# EAGLE design donut (EAGLE 7.6.0)
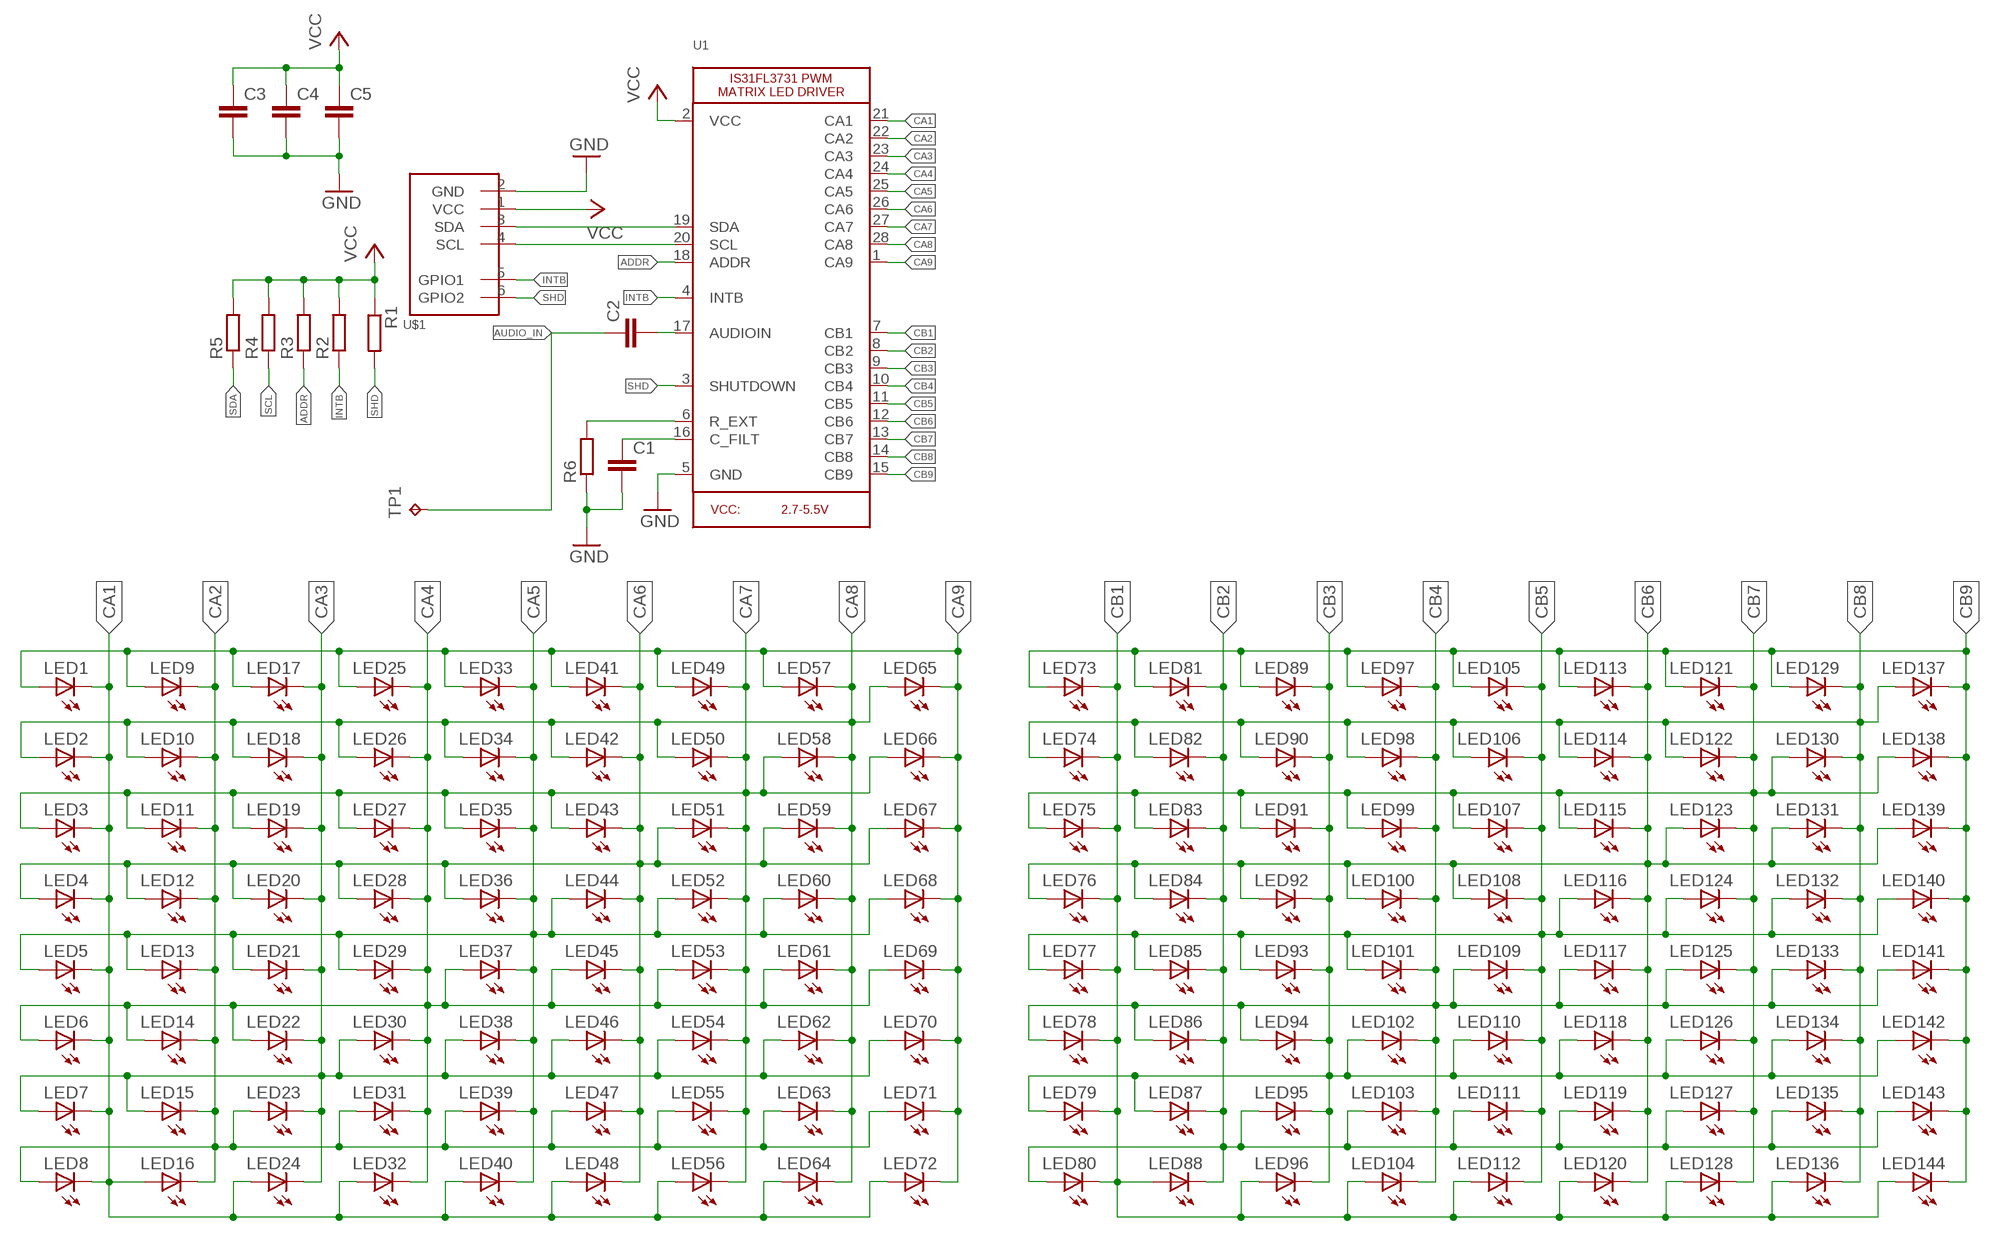
[diagram p0: schematic, sheet 1]

## Parts
C1  C-EUC0603  [C0603]
C2  C-EUC0603  [C0603]
C3  C-EUC0603  [C0603]
C4  C-EUC0603  [C0603]
C5  C-EUC0603  [C0603]
LED1  LEDCHIP-LED0603  [CHIP-LED0603]
LED2  LEDCHIP-LED0603  [CHIP-LED0603]
LED3  LEDCHIP-LED0603  [CHIP-LED0603]
LED4  LEDCHIP-LED0603  [CHIP-LED0603]
LED5  LEDCHIP-LED0603  [CHIP-LED0603]
LED6  LEDCHIP-LED0603  [CHIP-LED0603]
LED7  LEDCHIP-LED0603  [CHIP-LED0603]
LED8  LEDCHIP-LED0603  [CHIP-LED0603]
LED9  LEDCHIP-LED0603  [CHIP-LED0603]
LED10  LEDCHIP-LED0603  [CHIP-LED0603]
LED11  LEDCHIP-LED0603  [CHIP-LED0603]
LED12  LEDCHIP-LED0603  [CHIP-LED0603]
LED13  LEDCHIP-LED0603  [CHIP-LED0603]
LED14  LEDCHIP-LED0603  [CHIP-LED0603]
LED15  LEDCHIP-LED0603  [CHIP-LED0603]
LED16  LEDCHIP-LED0603  [CHIP-LED0603]
LED17  LEDCHIP-LED0603  [CHIP-LED0603]
LED18  LEDCHIP-LED0603  [CHIP-LED0603]
LED19  LEDCHIP-LED0603  [CHIP-LED0603]
LED20  LEDCHIP-LED0603  [CHIP-LED0603]
LED21  LEDCHIP-LED0603  [CHIP-LED0603]
LED22  LEDCHIP-LED0603  [CHIP-LED0603]
LED23  LEDCHIP-LED0603  [CHIP-LED0603]
LED24  LEDCHIP-LED0603  [CHIP-LED0603]
LED25  LEDCHIP-LED0603  [CHIP-LED0603]
LED26  LEDCHIP-LED0603  [CHIP-LED0603]
LED27  LEDCHIP-LED0603  [CHIP-LED0603]
LED28  LEDCHIP-LED0603  [CHIP-LED0603]
LED29  LEDCHIP-LED0603  [CHIP-LED0603]
LED30  LEDCHIP-LED0603  [CHIP-LED0603]
LED31  LEDCHIP-LED0603  [CHIP-LED0603]
LED32  LEDCHIP-LED0603  [CHIP-LED0603]
LED33  LEDCHIP-LED0603  [CHIP-LED0603]
LED34  LEDCHIP-LED0603  [CHIP-LED0603]
LED35  LEDCHIP-LED0603  [CHIP-LED0603]
LED36  LEDCHIP-LED0603  [CHIP-LED0603]
LED37  LEDCHIP-LED0603  [CHIP-LED0603]
LED38  LEDCHIP-LED0603  [CHIP-LED0603]
LED39  LEDCHIP-LED0603  [CHIP-LED0603]
LED40  LEDCHIP-LED0603  [CHIP-LED0603]
LED41  LEDCHIP-LED0603  [CHIP-LED0603]
LED42  LEDCHIP-LED0603  [CHIP-LED0603]
LED43  LEDCHIP-LED0603  [CHIP-LED0603]
LED44  LEDCHIP-LED0603  [CHIP-LED0603]
LED45  LEDCHIP-LED0603  [CHIP-LED0603]
LED46  LEDCHIP-LED0603  [CHIP-LED0603]
LED47  LEDCHIP-LED0603  [CHIP-LED0603]
LED48  LEDCHIP-LED0603  [CHIP-LED0603]
LED49  LEDCHIP-LED0603  [CHIP-LED0603]
LED50  LEDCHIP-LED0603  [CHIP-LED0603]
LED51  LEDCHIP-LED0603  [CHIP-LED0603]
LED52  LEDCHIP-LED0603  [CHIP-LED0603]
LED53  LEDCHIP-LED0603  [CHIP-LED0603]
LED54  LEDCHIP-LED0603  [CHIP-LED0603]
LED55  LEDCHIP-LED0603  [CHIP-LED0603]
LED56  LEDCHIP-LED0603  [CHIP-LED0603]
LED57  LEDCHIP-LED0603  [CHIP-LED0603]
LED58  LEDCHIP-LED0603  [CHIP-LED0603]
LED59  LEDCHIP-LED0603  [CHIP-LED0603]
LED60  LEDCHIP-LED0603  [CHIP-LED0603]
LED61  LEDCHIP-LED0603  [CHIP-LED0603]
LED62  LEDCHIP-LED0603  [CHIP-LED0603]
LED63  LEDCHIP-LED0603  [CHIP-LED0603]
LED64  LEDCHIP-LED0603  [CHIP-LED0603]
LED65  LEDCHIP-LED0603  [CHIP-LED0603]
LED66  LEDCHIP-LED0603  [CHIP-LED0603]
LED67  LEDCHIP-LED0603  [CHIP-LED0603]
LED68  LEDCHIP-LED0603  [CHIP-LED0603]
LED69  LEDCHIP-LED0603  [CHIP-LED0603]
LED70  LEDCHIP-LED0603  [CHIP-LED0603]
LED71  LEDCHIP-LED0603  [CHIP-LED0603]
LED72  LEDCHIP-LED0603  [CHIP-LED0603]
LED73  LEDCHIP-LED0603  [CHIP-LED0603]
LED74  LEDCHIP-LED0603  [CHIP-LED0603]
LED75  LEDCHIP-LED0603  [CHIP-LED0603]
LED76  LEDCHIP-LED0603  [CHIP-LED0603]
LED77  LEDCHIP-LED0603  [CHIP-LED0603]
LED78  LEDCHIP-LED0603  [CHIP-LED0603]
LED79  LEDCHIP-LED0603  [CHIP-LED0603]
LED80  LEDCHIP-LED0603  [CHIP-LED0603]
LED81  LEDCHIP-LED0603  [CHIP-LED0603]
LED82  LEDCHIP-LED0603  [CHIP-LED0603]
LED83  LEDCHIP-LED0603  [CHIP-LED0603]
LED84  LEDCHIP-LED0603  [CHIP-LED0603]
LED85  LEDCHIP-LED0603  [CHIP-LED0603]
LED86  LEDCHIP-LED0603  [CHIP-LED0603]
LED87  LEDCHIP-LED0603  [CHIP-LED0603]
LED88  LEDCHIP-LED0603  [CHIP-LED0603]
LED89  LEDCHIP-LED0603  [CHIP-LED0603]
LED90  LEDCHIP-LED0603  [CHIP-LED0603]
LED91  LEDCHIP-LED0603  [CHIP-LED0603]
LED92  LEDCHIP-LED0603  [CHIP-LED0603]
LED93  LEDCHIP-LED0603  [CHIP-LED0603]
LED94  LEDCHIP-LED0603  [CHIP-LED0603]
LED95  LEDCHIP-LED0603  [CHIP-LED0603]
LED96  LEDCHIP-LED0603  [CHIP-LED0603]
LED97  LEDCHIP-LED0603  [CHIP-LED0603]
LED98  LEDCHIP-LED0603  [CHIP-LED0603]
LED99  LEDCHIP-LED0603  [CHIP-LED0603]
LED100  LEDCHIP-LED0603  [CHIP-LED0603]
LED101  LEDCHIP-LED0603  [CHIP-LED0603]
LED102  LEDCHIP-LED0603  [CHIP-LED0603]
LED103  LEDCHIP-LED0603  [CHIP-LED0603]
LED104  LEDCHIP-LED0603  [CHIP-LED0603]
LED105  LEDCHIP-LED0603  [CHIP-LED0603]
LED106  LEDCHIP-LED0603  [CHIP-LED0603]
LED107  LEDCHIP-LED0603  [CHIP-LED0603]
LED108  LEDCHIP-LED0603  [CHIP-LED0603]
LED109  LEDCHIP-LED0603  [CHIP-LED0603]
LED110  LEDCHIP-LED0603  [CHIP-LED0603]
LED111  LEDCHIP-LED0603  [CHIP-LED0603]
LED112  LEDCHIP-LED0603  [CHIP-LED0603]
LED113  LEDCHIP-LED0603  [CHIP-LED0603]
LED114  LEDCHIP-LED0603  [CHIP-LED0603]
LED115  LEDCHIP-LED0603  [CHIP-LED0603]
LED116  LEDCHIP-LED0603  [CHIP-LED0603]
LED117  LEDCHIP-LED0603  [CHIP-LED0603]
LED118  LEDCHIP-LED0603  [CHIP-LED0603]
LED119  LEDCHIP-LED0603  [CHIP-LED0603]
LED120  LEDCHIP-LED0603  [CHIP-LED0603]
LED121  LEDCHIP-LED0603  [CHIP-LED0603]
LED122  LEDCHIP-LED0603  [CHIP-LED0603]
LED123  LEDCHIP-LED0603  [CHIP-LED0603]
LED124  LEDCHIP-LED0603  [CHIP-LED0603]
LED125  LEDCHIP-LED0603  [CHIP-LED0603]
LED126  LEDCHIP-LED0603  [CHIP-LED0603]
LED127  LEDCHIP-LED0603  [CHIP-LED0603]
LED128  LEDCHIP-LED0603  [CHIP-LED0603]
LED129  LEDCHIP-LED0603  [CHIP-LED0603]
LED130  LEDCHIP-LED0603  [CHIP-LED0603]
LED131  LEDCHIP-LED0603  [CHIP-LED0603]
LED132  LEDCHIP-LED0603  [CHIP-LED0603]
LED133  LEDCHIP-LED0603  [CHIP-LED0603]
LED134  LEDCHIP-LED0603  [CHIP-LED0603]
LED135  LEDCHIP-LED0603  [CHIP-LED0603]
LED136  LEDCHIP-LED0603  [CHIP-LED0603]
LED137  LEDCHIP-LED0603  [CHIP-LED0603]
LED138  LEDCHIP-LED0603  [CHIP-LED0603]
LED139  LEDCHIP-LED0603  [CHIP-LED0603]
LED140  LEDCHIP-LED0603  [CHIP-LED0603]
LED141  LEDCHIP-LED0603  [CHIP-LED0603]
LED142  LEDCHIP-LED0603  [CHIP-LED0603]
LED143  LEDCHIP-LED0603  [CHIP-LED0603]
LED144  LEDCHIP-LED0603  [CHIP-LED0603]
R1  R-EU_R0603  [R0603]
R2  R-EU_R0603  [R0603]
R3  R-EU_R0603  [R0603]
R4  R-EU_R0603  [R0603]
R5  R-EU_R0603  [R0603]
R6  R-EU_R0603  [R0603]
TP1  TPB1,27  [B1,27]
U1  IS31FL3731SSOP  [SSOP28DB]
U$1  SAO-SHITTY-ADDONBADGE  [2X3-SHROUDED]

## Nets
ADDR: R3.1 U1.18(ADDR)
AIN: C2.2 U1.17(AUDIOIN)
AUDIO_IN: C2.1 TP1.TP
CA1: LED1.C LED2.C LED3.C LED4.C LED5.C LED6.C LED7.C LED8.C LED16.A LED24.A LED32.A LED40.A LED48.A LED56.A LED64.A LED72.A U1.21(CA1)
CA2: LED8.A LED9.C LED10.C LED11.C LED12.C LED13.C LED14.C LED15.C LED16.C LED23.A LED31.A LED39.A LED47.A LED55.A LED63.A LED71.A U1.22(CA2)
CA3: LED7.A LED15.A LED17.C LED18.C LED19.C LED20.C LED21.C LED22.C LED23.C LED24.C LED30.A LED38.A LED46.A LED54.A LED62.A LED70.A U1.23(CA3)
CA4: LED6.A LED14.A LED22.A LED25.C LED26.C LED27.C LED28.C LED29.C LED30.C LED31.C LED32.C LED37.A LED45.A LED53.A LED61.A LED69.A U1.24(CA4)
CA5: LED5.A LED13.A LED21.A LED29.A LED33.C LED34.C LED35.C LED36.C LED37.C LED38.C LED39.C LED40.C LED44.A LED52.A LED60.A LED68.A U1.25(CA5)
CA6: LED4.A LED12.A LED20.A LED28.A LED36.A LED41.C LED42.C LED43.C LED44.C LED45.C LED46.C LED47.C LED48.C LED51.A LED59.A LED67.A U1.26(CA6)
CA7: LED3.A LED11.A LED19.A LED27.A LED35.A LED43.A LED49.C LED50.C LED51.C LED52.C LED53.C LED54.C LED55.C LED56.C LED58.A LED66.A U1.27(CA7)
CA8: LED2.A LED10.A LED18.A LED26.A LED34.A LED42.A LED50.A LED57.C LED58.C LED59.C LED60.C LED61.C LED62.C LED63.C LED64.C LED65.A U1.28(CA8)
CA9: LED1.A LED9.A LED17.A LED25.A LED33.A LED41.A LED49.A LED57.A LED65.C LED66.C LED67.C LED68.C LED69.C LED70.C LED71.C LED72.C U1.1(CA9)
CB1: LED73.C LED74.C LED75.C LED76.C LED77.C LED78.C LED79.C LED80.C LED88.A LED96.A LED104.A LED112.A LED120.A LED128.A LED136.A LED144.A U1.7(CB1)
CB2: LED80.A LED81.C LED82.C LED83.C LED84.C LED85.C LED86.C LED87.C LED88.C LED95.A LED103.A LED111.A LED119.A LED127.A LED135.A LED143.A U1.8(CB2)
CB3: LED79.A LED87.A LED89.C LED90.C LED91.C LED92.C LED93.C LED94.C LED95.C LED96.C LED102.A LED110.A LED118.A LED126.A LED134.A LED142.A U1.9(CB3)
CB4: LED78.A LED86.A LED94.A LED97.C LED98.C LED99.C LED100.C LED101.C LED102.C LED103.C LED104.C LED109.A LED117.A LED125.A LED133.A LED141.A U1.10(CB4)
CB5: LED77.A LED85.A LED93.A LED101.A LED105.C LED106.C LED107.C LED108.C LED109.C LED110.C LED111.C LED112.C LED116.A LED124.A LED132.A LED140.A U1.11(CB5)
CB6: LED76.A LED84.A LED92.A LED100.A LED108.A LED113.C LED114.C LED115.C LED116.C LED117.C LED118.C LED119.C LED120.C LED123.A LED131.A LED139.A U1.12(CB6)
CB7: LED75.A LED83.A LED91.A LED99.A LED107.A LED115.A LED121.C LED122.C LED123.C LED124.C LED125.C LED126.C LED127.C LED128.C LED130.A LED138.A U1.13(CB7)
CB8: LED74.A LED82.A LED90.A LED98.A LED106.A LED114.A LED122.A LED129.C LED130.C LED131.C LED132.C LED133.C LED134.C LED135.C LED136.C LED137.A U1.14(CB8)
CB9: LED73.A LED81.A LED89.A LED97.A LED105.A LED113.A LED121.A LED129.A LED137.C LED138.C LED139.C LED140.C LED141.C LED142.C LED143.C LED144.C U1.15(CB9)
GND: C1.2 C3.2 C4.2 C5.2 R6.1 U1.5(GND) U$1.2(GND)
INTB: R2.1 U1.4(INTB) U$1.5(GPIO1)
N$9: R6.2 U1.6(R_EXT)
N$10: C1.1 U1.16(C_FILT)
SCL: R4.1 U1.20(SCL) U$1.4(SCL)
SDA: R5.1 U1.19(SDA) U$1.3(SDA)
SHD: R1.2 U1.3(SHUTDOWN) U$1.6(GPIO2)
VCC: C3.1 C4.1 C5.1 R1.1 R2.2 R3.2 R4.2 R5.2 U1.2(VCC) U$1.1(VCC)

## Library data of the parts
C1-C5 = rcl:C-EU: CAPACITOR, European symbol
LED1-LED144 = led:LED: LED OSRAM: - CHIPLED LG R971, LG N971, LY N971, LG Q971, LY Q971, LO R971, LY R971 LH N974, LH R974 LS Q976, LO Q976, LY Q976 LO Q996 - Hyper CHIPLED LW Q18S LB Q993, LB Q99A, LB R99A - SideLED LS A670, LO A670, LY A670, LG A670, LP A670 LB A673, LV A673, LT A673, LW A673 LH A674 LY A675 LS A676, LA A676, LO A676, LY A676, LW A676 LS A679, LY A679, LG A679 - Hyper Micro SIDELED® LS Y876, LA Y876, LO Y876, LY Y876 LT Y87S - SmartLED LW L88C, LW L88S LB L89C, LB L89S, LG L890 LS L89K, LO L89K, LY L89K LS L896, LA L896, LO L896, LY L896 - TOPLED LS T670, LO T670, LY T670, LG T670, LP T670 LSG T670, LSP T670, LSY T670, LOP T670, LYG T670 LG T671, LOG T671, LSG T671 LB T673, LV T673, LT T673, LW T673 LH T674 LS T676, LA T676, LO T676, LY T676, LB T676, LH T676, LSB T676, LW T676 LB T67C, LV T67C, LT T67C, LS T67K, LO T67K, LY T67K, LW E67C LS E67B, LA E67B, LO E67B, LY E67B, LB E67C, LV E67C, LT E67C LW T67C LS T679, LY T679, LG T679 LS T770, LO T770, LY T770, LG T770, LP T770 LB T773, LV T773, LT T773, LW T773 LH T774 LS E675, LA E675, LY E675, LS T675 LS T776, LA T776, LO T776, LY T776, LB T776 LHGB T686 LT T68C, LB T68C - Hyper Mini TOPLED® LB M676 - Mini TOPLED Santana® LG M470 LS M47K, LO M47K, LY M47K Source: http://www.osram.convergy.de LUXEON: - LUMILED® LXK2-PW12-R00, LXK2-PW12-S00, LXK2-PW14-U00, LXK2-PW14-V00 LXK2-PM12-R00, LXK2-PM12-S00, LXK2-PM14-U00 LXK2-PE12-Q00, LXK2-PE12-R00, LXK2-PE12-S00, LXK2-PE14-T00, LXK2-PE14-U00 LXK2-PB12-K00, LXK2-PB12-L00, LXK2-PB12-M00, LXK2-PB14-N00, LXK2-PB14-P00, LXK2-PB14-Q00 LXK2-PR12-L00, LXK2-PR12-M00, LXK2-PR14-Q00, LXK2-PR14-R00 LXK2-PD12-Q00, LXK2-PD12-R00, LXK2-PD12-S00 LXK2-PH12-R00, LXK2-PH12-S00 LXK2-PL12-P00, LXK2-PL12-Q00, LXK2-PL12-R00 Source: www.luxeon.com KINGBRIGHT: KA-3528ASYC Source: www.kingbright.com
R1-R6 = rcl:R-EU_: RESISTOR, European symbol
TP1 = testpad:TP: Test pad
U1 = nightcapaudio:IS31FL3731: IS31FL3731 PWM LED Matrix Driver
U$1 = SparkFun-Connectors:SAO-SHITTY-ADDON

## Board
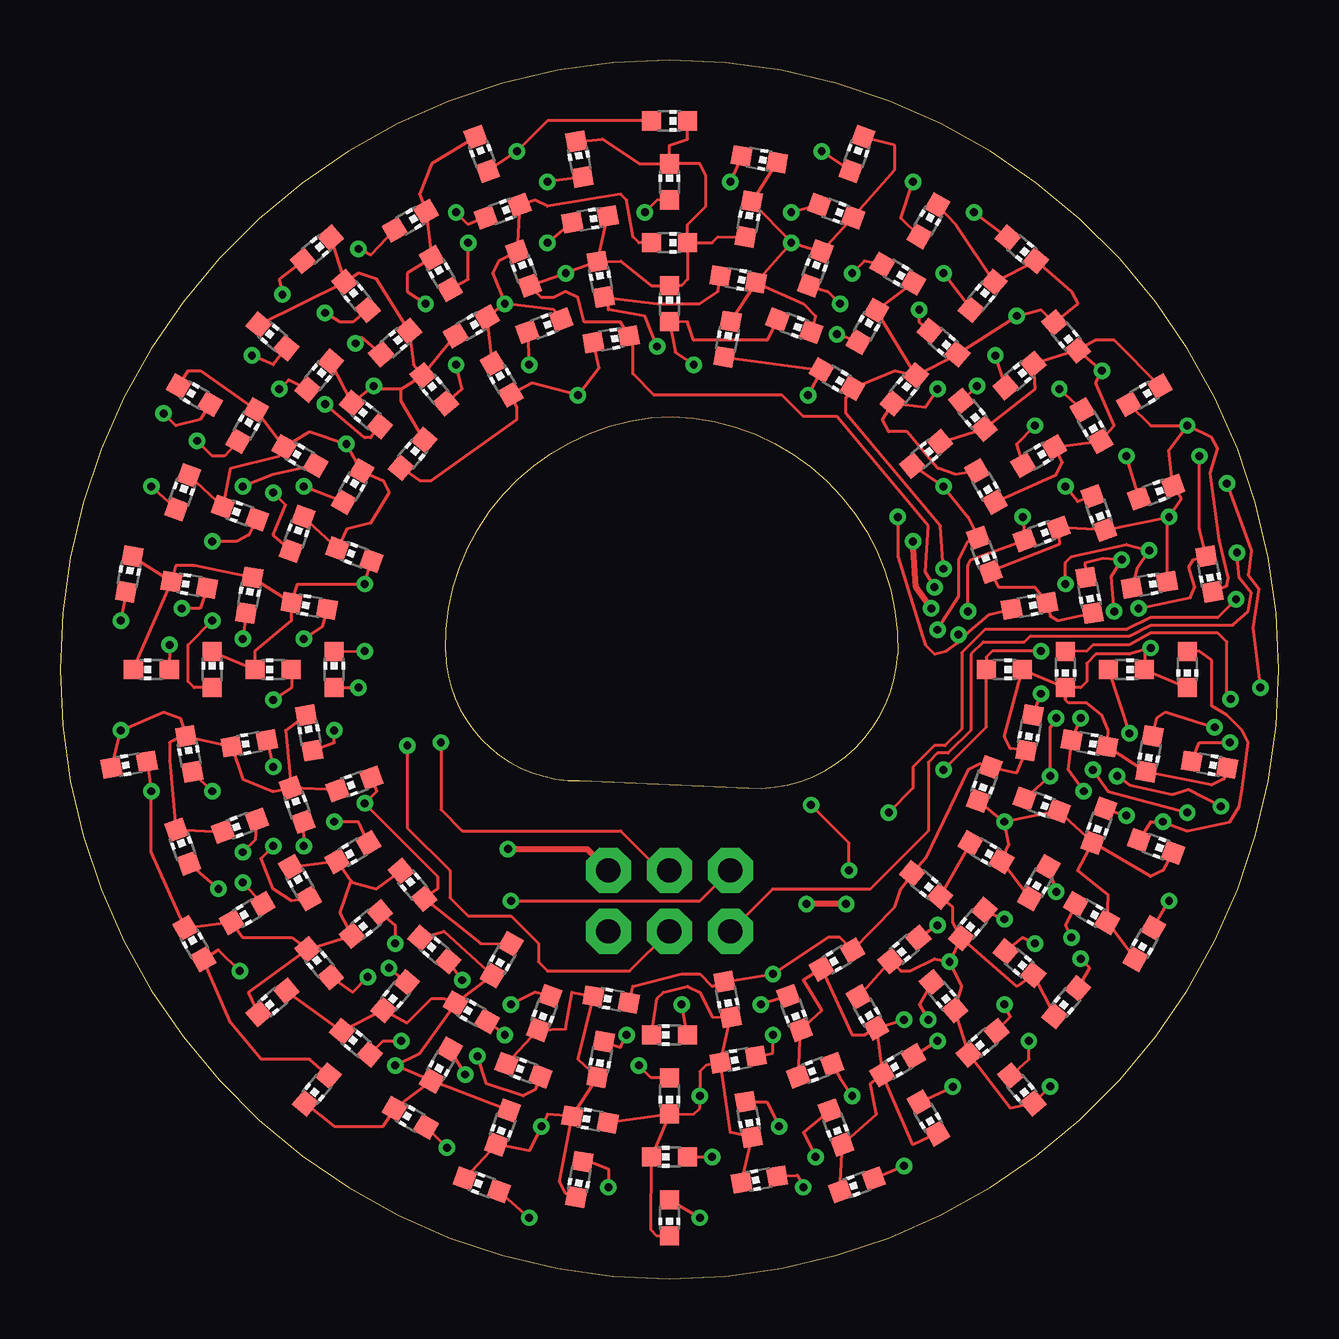
[diagram p1: board, top side]
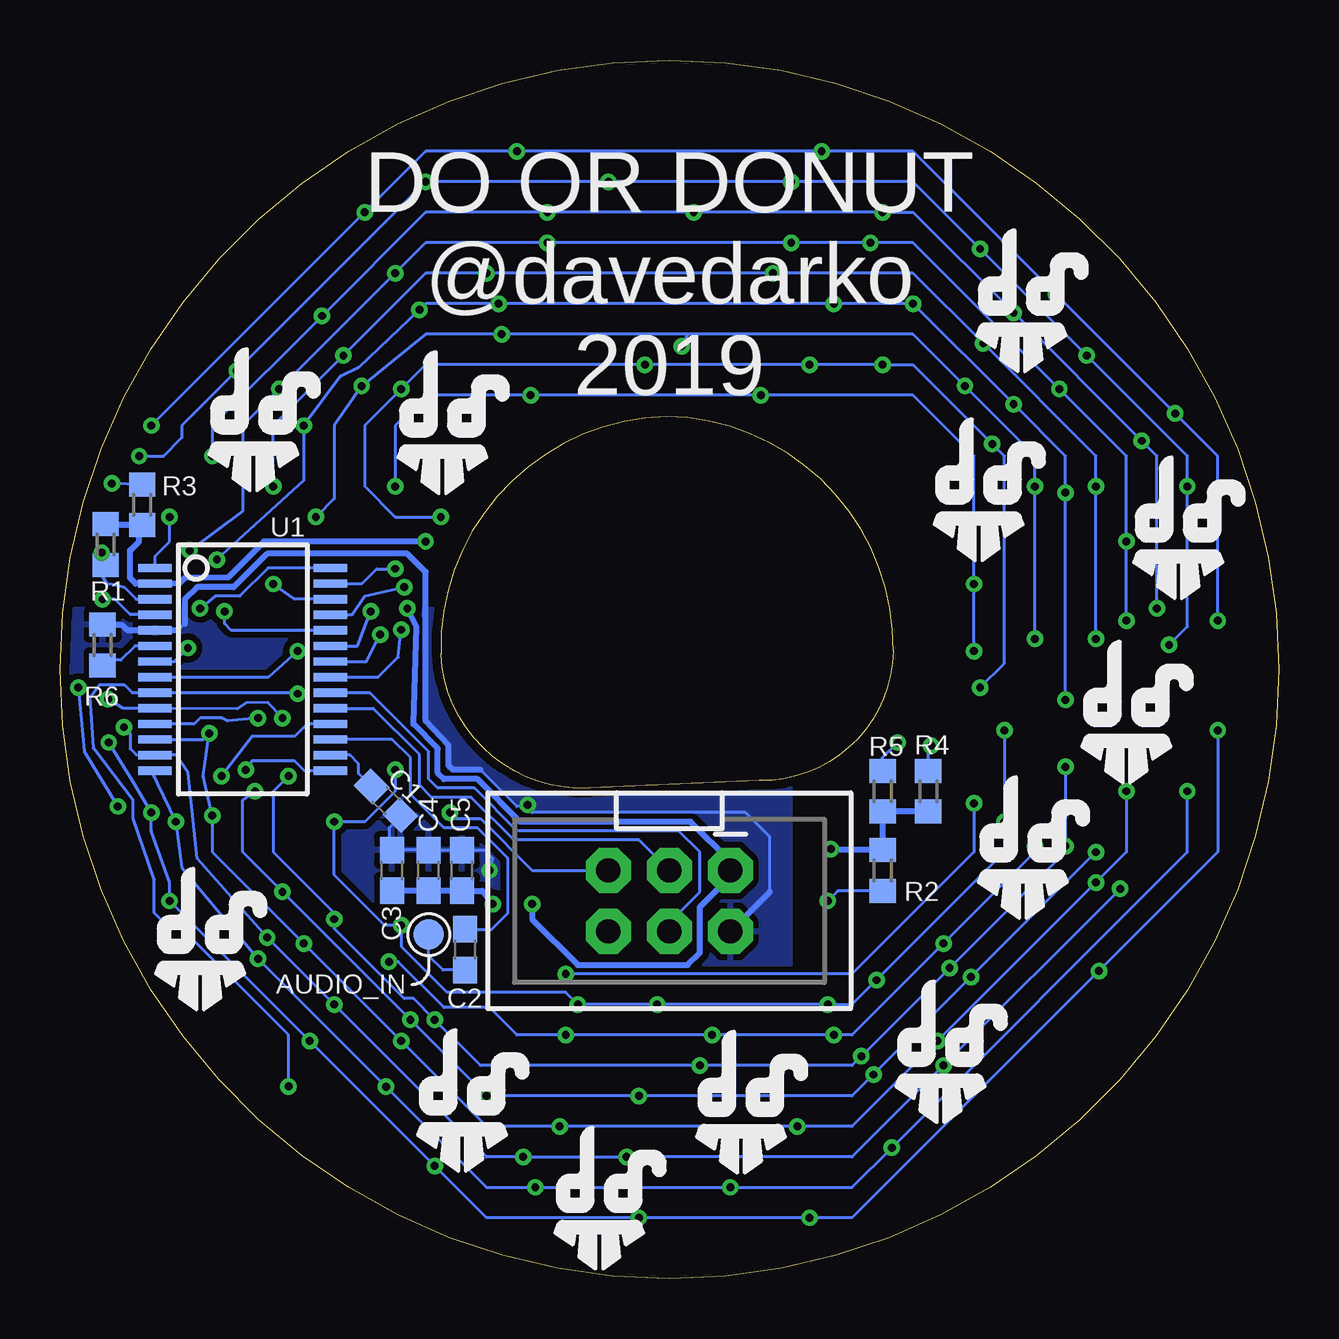
[diagram p2: board, bottom side, seen from below]

Size 50.8 x 50.8 mm. Coordinates in mm from the lower left corner, seen from the top.
Outline: 0,25.4 arc90 25.4,0 arc90 50.8,25.4 arc90 25.4,50.8 arc90 0,25.4
Outline: 16.07,26.16 arc-90 25.53,35.94 arc-90 34.92,26.04 arc-90 28.7,20.45 21.65,20.77 arc-90 16.07,26.16
Copper layers (1*16): Top 0.0356mm / dielectric 1.5011mm / Bottom 0.0356mm
Design rules "LaenPCBOrder *": minimum track width 5mil, minimum drill 13mil, track to track 5mil, track to pad 5mil, pad to pad 5mil, via to via 5mil, smd to smd 5mil, copper to edge 15mil, drill to drill 6mil, minimum pad ring 7mil, minimum via ring 7mil, stop-mask expansion 3mil, vias tented up to drill 200mil, thermal gap 10mil

### Footprints (pad centres in the part's own frame; a part is rotated, then mirrored left to right if it is on the bottom)
C0603 = smd 1.1 x 1: 1 -0.85,0; 2 0.85,0
CHIP-LED0603 = smd 0.8 x 0.8: A 0,-0.75; C 0,0.75
R0603 = smd 1 x 1.1: 1 -0.85,0; 2 0.85,0
B1,27 = smd 1.27 x 1.27: TP 0,0
SSOP28DB = smd 0.348 x 1.397: 1 -4.225,-3.656; 2 -3.575,-3.656; 3 -2.925,-3.656; 4 -2.275,-3.656; 5 -1.625,-3.656; 6 -0.975,-3.656; 7 -0.325,-3.656; 8 0.325,-3.656; 9 0.975,-3.656; 10 1.625,-3.656; 11 2.275,-3.656; 12 2.925,-3.656; 13 3.575,-3.656; 14 4.225,-3.656; 15 4.225,3.656; 16 3.575,3.656; 17 2.925,3.656; 18 2.275,3.656; 19 1.625,3.656; 20 0.975,3.656; 21 0.325,3.656; 22 -0.325,3.656; 23 -0.975,3.656; 24 -1.625,3.656; 25 -2.275,3.656; 26 -2.925,3.656; 27 -3.575,3.656; 28 -4.225,3.656
2X3-SHROUDED = drill 1.016 pad 1.88 octagon: 1 -1.27,2.54; 2 1.27,2.54; 3 -1.27,0; 4 1.27,0; 5 -1.27,-2.54; 6 1.27,-2.54

### Placement (x,y rotation side)
C1  37.21,19.92 315 bottom
C2  33.91,13.72 90 bottom
C3  36.96,17.02 90 bottom
C4  35.43,17.02 90 bottom
C5  34.04,17.02 90 bottom
LED1  2.89,29.37 350 top
LED2  3.81,25.4 90 top
LED3  5.39,28.93 80 top
LED4  6.35,25.4 0 top
LED5  7.89,28.49 350 top
LED6  8.89,25.4 90 top
LED7  10.39,28.05 80 top
LED8  11.43,25.4 0 top
LED9  5.6,36.83 60 top
LED10  5.11,32.78 340 top
LED11  7.8,35.56 330 top
LED12  7.5,31.92 70 top
LED13  10,34.29 60 top
LED14  9.89,31.05 340 top
LED15  12.2,33.02 330 top
LED16  12.27,30.18 70 top
LED17  10.71,42.91 310 top
LED18  8.86,39.28 50 top
LED19  12.34,40.97 40 top
LED20  10.81,37.65 320 top
LED21  13.97,39.02 310 top
LED22  12.75,36.01 50 top
LED23  15.6,37.07 40 top
LED24  14.7,34.38 320 top
LED25  17.58,46.88 20 top
LED26  14.6,44.1 300 top
LED27  18.45,44.49 290 top
LED28  15.87,41.9 30 top
LED29  19.32,42.11 20 top
LED30  17.14,39.7 300 top
LED31  20.19,39.72 290 top
LED32  18.41,37.5 30 top
LED33  25.4,48.26 270 top
LED34  21.65,46.66 10 top
LED35  25.4,45.72 0 top
LED36  22.09,44.16 280 top
LED37  25.4,43.18 270 top
LED38  22.53,41.66 10 top
LED39  25.4,40.64 0 top
LED40  22.97,39.16 280 top
LED41  33.22,46.88 340 top
LED42  29.15,46.66 260 top
LED43  32.35,44.49 250 top
LED44  28.71,44.16 350 top
LED45  31.48,42.11 340 top
LED46  28.27,41.66 260 top
LED47  30.61,39.72 250 top
LED48  27.83,39.16 350 top
LED49  40.09,42.91 230 top
LED50  36.2,44.1 330 top
LED51  38.46,40.97 320 top
LED52  34.92,41.9 240 top
LED53  36.83,39.02 230 top
LED54  33.65,39.7 330 top
LED55  35.2,37.07 320 top
LED56  32.38,37.5 240 top
LED57  45.2,36.83 300 top
LED58  41.94,39.28 220 top
LED59  43,35.56 210 top
LED60  39.99,37.65 310 top
LED61  40.8,34.29 300 top
LED62  38.05,36.01 220 top
LED63  38.6,33.02 210 top
LED64  36.1,34.38 310 top
LED65  47.91,29.37 190 top
LED66  45.69,32.78 290 top
LED67  45.41,28.93 280 top
LED68  43.3,31.92 200 top
LED69  42.91,28.49 190 top
LED70  40.91,31.05 290 top
LED71  40.41,28.05 280 top
LED72  38.53,30.18 200 top
LED73  47.91,21.43 260 top
LED74  46.99,25.4 180 top
LED75  45.41,21.87 170 top
LED76  44.45,25.4 270 top
LED77  42.91,22.31 260 top
LED78  41.91,25.4 180 top
LED79  40.41,22.75 170 top
LED80  39.37,25.4 270 top
LED81  45.2,13.97 150 top
LED82  45.69,18.02 250 top
LED83  43,15.24 240 top
LED84  43.3,18.88 160 top
LED85  40.8,16.51 150 top
LED86  40.91,19.75 250 top
LED87  38.6,17.78 240 top
LED88  38.53,20.62 160 top
LED89  40.09,7.89 220 top
LED90  41.94,11.52 140 top
LED91  38.46,9.83 130 top
LED92  39.99,13.15 230 top
LED93  36.83,11.78 220 top
LED94  38.05,14.79 140 top
LED95  35.2,13.73 130 top
LED96  36.1,16.42 230 top
LED97  33.22,3.92 110 top
LED98  36.19,6.7 210 top
LED99  32.35,6.31 200 top
LED100  34.92,8.9 120 top
LED101  31.48,8.69 110 top
LED102  33.65,11.1 210 top
LED103  30.61,11.08 200 top
LED104  32.38,13.3 120 top
LED105  25.4,2.54 180 top
LED106  29.15,4.14 100 top
LED107  25.4,5.08 90 top
LED108  28.71,6.64 190 top
LED109  25.4,7.62 180 top
LED110  28.27,9.14 100 top
LED111  25.4,10.16 90 top
LED112  27.83,11.64 190 top
LED113  17.58,3.92 70 top
LED114  21.65,4.14 170 top
LED115  18.45,6.31 160 top
LED116  22.09,6.64 80 top
LED117  19.32,8.69 70 top
LED118  22.53,9.14 170 top
LED119  20.19,11.08 160 top
LED120  22.97,11.64 80 top
LED121  10.71,7.89 140 top
LED122  14.6,6.7 60 top
LED123  12.34,9.83 50 top
LED124  15.87,8.9 150 top
LED125  13.97,11.78 140 top
LED126  17.14,11.1 60 top
LED127  15.6,13.73 50 top
LED128  18.41,13.3 150 top
LED129  5.6,13.97 30 top
LED130  8.86,11.52 130 top
LED131  7.8,15.24 120 top
LED132  10.81,13.15 40 top
LED133  10,16.51 30 top
LED134  12.75,14.79 130 top
LED135  12.2,17.78 120 top
LED136  14.7,16.42 40 top
LED137  2.89,21.43 100 top
LED138  5.11,18.02 20 top
LED139  5.39,21.87 10 top
LED140  7.5,18.88 110 top
LED141  7.89,22.31 100 top
LED142  9.89,19.75 20 top
LED143  10.39,22.75 10 top
LED144  12.27,20.62 110 top
R1  48.9,30.61 270 bottom
R2  16.51,17.02 90 bottom
R3  47.37,32.26 270 bottom
R4  14.61,20.32 270 bottom
R5  16.51,20.32 270 bottom
R6  49.02,26.42 270 bottom
TP1  35.43,14.35 0 bottom
U1  43.18,25.4 270 bottom
U$1  25.4,15.75 270 bottom
U$2  [DAVEDARKO2_LOGO]  6.35,22.86 0 bottom
U$3  [DAVEDARKO2_LOGO]  12.51,32.13 0 bottom
U$4  [DAVEDARKO2_LOGO]  10.67,17.21 0 bottom
U$5  [DAVEDARKO2_LOGO]  44.96,13.4 0 bottom
U$6  [DAVEDARKO2_LOGO]  22.42,6.6 0 bottom
U$7  [DAVEDARKO2_LOGO]  42.74,35.05 0 bottom
U$8  [DAVEDARKO2_LOGO]  34.04,6.67 0 bottom
U$9  [DAVEDARKO2_LOGO]  34.86,34.92 0 bottom
U$10  [DAVEDARKO2_LOGO]  10.73,40.01 0 bottom
U$11  [DAVEDARKO2_LOGO]  4.19,30.54 0 bottom
U$12  [DAVEDARKO2_LOGO]  28.32,2.6 0 bottom
U$13  [DAVEDARKO2_LOGO]  14.1,8.7 0 bottom

### Tracks (layer width: path | path; a pad name or v marks a point on that pad's centre or on a via)
ADDR  (via drill 0.33)
  Top 0.127: v44.07,20.95 44.58,20.57 46.35,20.19 47,20.39 v48.39,19.68 | v48.64,33.15 49.66,30.35 49.53,29.34 49.97,28.77 49.72,27.11 v50.04,24.64
  Bottom 0.127: U1.18 40.5,23.12 41.02,22.61 42.8,22.61 v44.07,20.95 | R3.1 v48.64,33.15 | v50.04,24.64 49.78,21.97 v48.39,19.68
AIN
  Bottom 0.127: C2.2 32.8,14.57 32.13,15.24 32.13,17.53 33.4,18.8 34.8,18.8 36.2,20.19 36.2,21.72 36.96,22.48 U1.17
AUDIO_IN
  Bottom 0.127: C2.1 34.84,12.87 35.43,13.46 TP1.TP
CA1  (via drill 0.33)
  Top 0.127: LED1.C LED3.C | LED3.C 4.83,29.72 5.59,29.72 LED5.C LED7.C | LED7.C 9.91,28.96 v12.7,28.96 LED16.A | LED2.C LED3.C | LED4.C LED6.C 8.13,26.16 9.65,27.43 LED7.C | LED8.C v12.7,26.16 | LED24.A 14.99,33.27 15.49,33.27 19.05,35.81 19.05,36.32 LED32.A 19.68,37.34 v21.59,36.83 22.48,37.97 LED40.A | LED48.A LED56.A v31.18,36.83 | LED64.A v36.83,33.02 37.85,31.75 LED72.A 37.85,30.73 37.47,29.97 37.47,28.45 v36.58,27.05
  Bottom 0.127: v12.7,26.16 v12.7,28.96 12.7,34.29 15.24,36.83 v21.59,36.83 v31.18,36.83 35.56,36.83 36.83,35.56 v36.83,33.02 | U1.21 37.54,25.07 36.7,25.91 v36.58,27.05
CA2  (via drill 0.33)
  Top 0.127: LED8.A v12.45,24.64 | LED13.C LED11.C 5.84,37.85 5.33,37.85 LED9.C | LED10.C LED12.C 7.11,33.78 9.14,34.29 LED13.C | LED14.C LED16.C 11.94,31.24 12.95,31.5 13.72,32.77 13.46,33.27 LED15.C v11.94,34.8 10.41,35.31 LED13.C | LED23.A 16.76,37.08 v16.51,38.1 | v26.42,38.1 25.65,38.61 LED39.A 26.16,39.88 26.42,39.12 29.46,39.12 LED47.A | LED31.A v19.56,38.1 | v36.58,37.08 36.07,36.32 LED55.A 34.29,35.81 34.54,35.31 35.31,35.31 36.58,33.78 37.34,33.53 LED63.A | v34.92,31.75 34.92,30.1 35.94,26.8 36.07,26.42 36.45,26.04 36.96,26.16 37.47,26.54 v37.45,26.84 37.77,26.84 38.73,27.69 LED71.A
  Bottom 0.127: v12.45,24.64 11.43,25.65 11.43,34.29 v11.94,34.8 15.24,38.1 v16.51,38.1 v19.56,38.1 v26.42,38.1 35.56,38.1 v36.58,37.08 38.1,35.56 38.1,33.03 36.83,31.75 v34.92,31.75 | U1.22 38.03,25.73 v37.45,26.84
CA3  (via drill 0.33)
  Top 0.127: LED7.A 10.92,27.18 v10.16,26.67 | LED24.C 14.22,36.58 14.22,37.08 | 14.22,37.08 LED23.C | LED20.C LED22.C v13.08,37.21 13.21,37.08 14.22,37.08 | LED17.C LED19.C | LED30.A LED23.C | LED23.C 14.73,38.1 LED21.C 13.21,41.66 12.45,41.91 LED19.C | LED15.A v10.16,33.02 | LED18.C LED19.C | LED46.A 27.43,41.15 26.67,40.64 24.89,40.64 LED38.A 22.86,40.64 | LED54.A v32.38,39.37 | v24.89,38.86 24.38,40.13 22.86,40.39 22.86,40.64 | 22.86,40.64 22.86,40.89 | LED62.A v38.23,37.21 | v40.13,31.75 LED70.A 37.97,29.97 37.85,29.72 v37.85,27.81
  Bottom 0.127: v10.16,26.67 v10.16,33.02 10.16,34.29 v13.08,37.21 15.24,39.37 24.64,39.37 | 24.64,39.37 v32.38,39.37 35.56,39.37 v38.23,37.21 39.37,35.56 39.37,32.51 v40.13,31.75 | 24.64,39.37 v24.89,38.86 | U1.23 38.4,26.38 v37.85,27.81
CA4  (via drill 0.33)
  Top 0.127: LED6.A 9.65,24.64 v8.89,24.13 | LED32.C LED30.C v18.54,40.64 | LED14.A 8.89,30.99 9.4,32.26 v8.89,32.77 | v15.24,40.64 14.48,41.15 14.48,41.91 LED28.C LED26.C 14.99,45.21 15.49,46.48 LED25.C | LED22.A 12.95,35.05 12.7,35.05 v11.05,36.45 | v18.54,40.64 18.03,41.91 18.29,42.42 LED29.C LED27.C 19.81,44.96 20.32,44.7 23.37,45.21 23.62,44.96 23.88,43.43 24.13,43.18 LED37.A | LED31.C 20.57,40.39 v18.54,40.64 | LED45.A 32,41.15 v32.51,40.64 | LED53.A 35.81,39.88 v35.81,40.39 | LED61.A 39.88,34.8 v40.64,35.56 | LED69.A 42.74,29.84 43.5,30.04 v44.26,29.97 43.81,29.27 v43.94,27.81
  Bottom 0.127: v8.89,24.13 v8.89,32.77 8.89,34.29 v11.05,36.45 v15.24,40.64 v18.54,40.64 v32.51,40.64 35.56,40.64 v35.81,40.39 38.35,37.97 39.12,37.59 v40.64,35.56 40.64,33.27 v44.26,29.97 | U1.24 43.66,27.02 43.94,27.3 v43.94,27.81
CA5  (via drill 0.33)
  Top 0.127: LED5.A v7.62,26.67 | LED13.A 8.89,33.53 v7.62,33.02 | LED21.A 12.57,39.24 v12.32,38.99 | LED38.C LED36.C | LED38.C 23.37,42.42 24.64,41.4 LED39.C 25.91,41.4 26.16,41.66 LED37.C | LED37.C 27.18,43.18 27.43,43.43 LED44.A | LED37.C 26.16,43.94 26.92,44.7 26.92,45.97 26.67,46.48 LED35.C | LED35.C 25.4,47.24 26.16,47.5 LED33.C | LED34.C 22.61,47.5 24.13,46.48 LED35.C | LED38.C v21.08,41.91 LED29.A 20.07,40.89 20.57,40.89 21.08,41.15 21.59,40.89 21.84,39.88 23.37,39.88 LED40.C 23.88,39.12 23.88,37.72 24.77,36.83 30.1,36.83 30.99,35.94 32.38,35.94 36.2,31.37 36.07,29.46 v36.45,28.83 | LED52.A 33.53,42.42 v33.02,41.91 | LED60.A v38.99,38.48 | LED68.A 42.42,32.38 v41.91,33.02
  Bottom 0.127: v7.62,26.67 v7.62,33.02 7.62,34.29 v12.32,38.99 15.24,41.91 v21.08,41.91 v33.02,41.91 35.56,41.91 v38.99,38.48 41.91,35.56 v41.91,33.02 | U1.25 38.62,27.68 38.1,28.45 v36.45,28.83
CA6  (via drill 0.33)
  Top 0.127: LED4.A 5.59,24.64 5.33,24.89 5.33,26.42 v6.35,27.43 | LED12.A 7.87,30.99 7.37,30.73 v6.35,30.73 | LED20.A 9.53,37.47 v9.14,37.08 | LED28.A 17.02,41.66 v17.02,43.18 | LED42.C LED44.C v30.48,43.18 | LED46.C v30.48,43.18 | v30.48,43.18 LED45.C LED43.C 34.8,46.23 34.8,47.24 LED41.C | LED46.C LED48.C | LED46.C 30.99,40.64 31.5,40.13 LED47.C | LED36.A v20.32,43.18 | LED51.A v36.83,41.91 | LED59.A v41.66,37.08 | LED67.A 44.9,29.59 v45.4,30.35 44.45,30.61 42.16,30.1 41.91,29.84 v41.91,28.96
  Bottom 0.127: v6.35,27.43 v6.35,30.73 6.35,34.29 v9.14,37.08 15.24,43.18 v17.02,43.18 v20.32,43.18 v30.48,43.18 35.56,43.18 v36.83,41.91 v41.66,37.08 43.18,35.56 43.18,32 v45.4,30.35 | U1.26 41.02,28.32 v41.91,28.96
CA7  (via drill 0.33)
  Top 0.127: LED3.A 5.84,27.94 v5.08,27.94 | LED11.A 6.86,34.29 6.35,34.29 v5.71,34.92 | LED19.A 12.19,39.88 11.68,39.88 v11.05,40.26 | LED27.A 17.02,43.94 v16.51,44.45 | LED55.C LED53.C v39.88,40.13 40.89,40.39 41.4,39.88 LED58.A 42.42,40.64 42.16,41.15 LED49.C LED51.C 37.34,43.94 LED50.C | LED52.C LED54.C LED55.C | LED43.A v30.48,44.45 | LED35.A 24.89,44.96 v24.38,44.45 | LED55.C 34.8,37.85 LED56.C 32.77,36.7 32.77,36.07 36.7,31.37 v36.83,29.59 | LED66.A v44.45,34.29
  Bottom 0.127: v5.08,27.94 5.08,34.29 v5.71,34.92 v11.05,40.26 15.24,44.45 v16.51,44.45 v24.38,44.45 v30.48,44.45 35.56,44.45 v39.88,40.13 44.45,35.56 v44.45,34.29 | U1.27 38.21,28.98 37.59,29.59 v36.83,29.59
CA8  (via drill 0.33)
  Top 0.127: v4.57,26.42 LED2.A | LED10.A v3.81,33.02 | LED18.A 8.89,38.1 v8,38.48 | LED26.A 12.95,42.67 v12.45,42.93 | LED34.A v20.32,45.72 | LED42.A v27.94,45.72 | LED58.C LED60.C 40.64,37.08 LED62.C LED64.C | LED50.A 35.05,44.2 v35.56,45.72 | LED57.C 43.94,39.12 43.18,39.12 LED58.C | LED58.C v43.43,37.85 43.18,37.34 43.94,35.56 LED59.C LED61.C 41.78,34.04 41.53,33.53 LED63.C | v47.5,34.29 47.5,31.24 LED65.A 47.24,29.97 47.05,29.65 47.31,28.83 47.12,28.38 v44.96,27.94
  Bottom 0.127: v4.57,26.42 3.81,27.18 v3.81,33.02 3.81,34.29 v8,38.48 v12.45,42.93 15.24,45.72 v20.32,45.72 v27.94,45.72 v35.56,45.72 v43.43,37.85 45.72,35.56 45.72,35.05 46.48,34.29 v47.5,34.29 | U1.28 42.13,29.62 43.31,28.45 44.32,28.45 v44.96,27.94
CA9  (via drill 0.33)
  Top 0.127: LED1.A v2.54,27.43 | LED9.A 5.84,35.81 4.83,35.56 v4.32,36.07 | LED17.A 9.14,41.66 v9.27,41.02 | LED25.A v19.05,46.99 20.32,48.26 LED33.A | LED41.A v31.75,46.99 | LED49.A v38.1,44.45 | LED57.A 45.47,35.56 v46.99,35.56 | v46.99,35.56 46.23,34.54 LED66.C 46.74,32.51 v46.23,31.75 | v46.23,31.75 LED68.C LED70.C 41.66,30.61 LED72.C 39.12,28.83 40.64,28.83 LED71.C 41.27,27.62 41.59,27.43 LED69.C | LED67.C 46.15,31.67 v46.23,31.75 | LED65.C 48.64,28.89 48.7,29.21 48.32,30.8 47.94,33.59 48.26,34.61 48.01,35.05 v46.99,35.56
  Bottom 0.127: v2.54,27.43 2.54,34.29 v4.32,36.07 v9.27,41.02 15.24,46.99 v19.05,46.99 v31.75,46.99 35.56,46.99 v38.1,44.45 v46.99,35.56 | U1.1 46.83,30.13 46.23,30.73 v46.23,31.75
CB1  (via drill 0.33)
  Top 0.127: LED144.A 13.21,20.32 v12.7,19.81 15.75,16.76 15.75,16.26 LED136.A 17.53,13.97 LED128.A | LED120.A 23.88,12.19 25.91,12.7 26.67,12.7 27.18,12.19 LED112.A v29.72,12.7 32,14.22 32.51,14.22 LED104.A 34.8,15.49 35.05,16.26 LED96.A 36.07,17.53 37.85,21.21 38.35,21.46 LED88.A 39.88,21.08 LED79.C 39.62,22.1 39.37,22.61 LED80.C LED78.C 41.91,24.13 | LED74.C LED76.C 45.21,25.41 45.21,26.04 v45.47,26.29 44.58,26.04 43.18,26.04 42.8,25.65 42.8,24.89 42.55,24.64 41.91,24.64 41.91,24.13 | 41.91,24.13 42.04,24 42.8,24 43.43,23.5 43.69,22.86 LED77.C LED75.C 48.01,20.57 48.51,20.83 LED73.C
  Bottom 0.127: v12.7,19.81 12.7,17.78 17.78,12.7 v29.72,12.7 | U1.7 46.03,25.73 v45.47,26.29
CB2  (via drill 0.33)
  Top 0.127: LED81.C LED83.C 43.69,16 42.42,17.02 LED84.C | LED85.C LED87.C 39.56,18.1 v39.37,19.05 | LED84.C LED86.C v39.37,19.05 | LED82.C 45.97,17.02 45.47,16.76 LED84.C | v39.37,19.05 LED88.C | LED143.A 11.43,22.35 v11.43,22.86 | LED135.A 12.45,19.05 v11.43,19.05 | LED127.A v16.76,12.45 | LED119.A 19.81,11.94 v18.8,11.43 | LED111.A v25.91,11.43 | LED103.A v29.21,11.43 | LED95.A v36.58,14.73 | v40.89,26.16 38.86,26.16 38.61,25.91 38.61,25.41 LED80.A 38.62,23 v36.83,21.21
  Bottom 0.127: v11.43,22.86 v11.43,19.05 11.43,17.78 v16.76,12.45 17.78,11.43 v18.8,11.43 v25.91,11.43 v29.21,11.43 29.72,11.94 34.67,11.94 36.58,13.84 v36.58,14.73 37.27,14.73 39.37,16.83 v39.37,19.05 38.1,19.05 36.83,20.32 v36.83,21.21 | U1.8 42.11,25.07 v40.89,26.16
CB3  (via drill 0.33)
  Top 0.127: LED90.C LED92.C 39.88,12.19 LED94.C | v37.08,13.21 37.59,12.19 LED93.C LED91.C 39.62,7.11 LED89.C v41.27,8.01 | v37.08,13.21 LED94.C | LED94.C 37.21,14.86 37.21,15.49 LED96.C LED87.A | LED102.A LED95.C 35.05,12.83 35.43,12.83 36.45,13.34 v37.08,13.21 | LED134.A 13.97,14.73 v13.97,13.97 | LED126.A v18.54,10.16 | LED118.A 23.37,9.65 v23.62,10.16 | LED142.A v10.16,18.03 | LED110.A 29.72,9.4 v29.72,10.16 | v40.89,24.38 LED79.A
  Bottom 0.127: v37.08,13.21 36.7,13.21 34.8,11.3 32.89,11.3 31.75,10.16 v29.72,10.16 v23.62,10.16 v18.54,10.16 17.78,10.16 v13.97,13.97 10.16,17.78 v10.16,18.03 | v40.89,24.38 40.81,24.43 U1.9 47.79,24.43 48.13,24.77 49.15,24.77 49.53,24.26 49.4,22.1 47.75,19.94 47.75,19.18 46.86,16.64 46.86,15.24 46.35,14.73 45.85,14.73 41.27,10.16 v41.27,8.01
CB4  (via drill 0.33)
  Top 0.127: LED101.C LED103.C 31.75,11.18 30.99,12.45 LED104.C 33.02,10.16 33.53,10.16 LED102.C | LED102.C LED100.C | LED97.C LED99.C 34.04,6.86 33.78,8.13 LED100.C | LED98.C 35.56,5.59 LED100.C | LED141.A v8.89,21.34 | LED133.A 9.65,15.75 8.89,16.26 8.38,17.53 v8.89,18.03 | LED125.A v13.72,12.95 | LED117.A 19.81,7.87 19.3,7.62 17.78,8.13 v17.4,9.27 | LED109.A 24.64,8.38 v24.13,8.89 | v35.18,10.79 34.04,10.41 LED102.C | LED94.A v39.37,14.99 | LED86.A v41.27,20.95 41.27,22.99 v41.53,23.37 | v48.79,24.16 48.64,24.38 48.64,26.54 48.26,26.92 45.47,26.92 44.58,26.42 43.05,26.42 42.8,26.16 LED78.A | LED78.A
  Bottom 0.127: v8.89,21.34 v8.89,18.03 8.89,17.78 v13.72,12.95 v17.4,9.27 17.78,8.89 v24.13,8.89 33.27,8.89 v35.18,10.79 36.07,11.68 36.45,11.68 39.37,14.61 v39.37,14.99 39.37,15.24 41.91,17.78 41.91,20.32 v41.27,20.95 | v41.53,23.37 42.14,24.03 43.05,24 43.43,23.75 U1.10 48.16,23.77 v48.79,24.16
CB5  (via drill 0.33)
  Top 0.127: LED110.C LED112.C 27.18,10.92 26.67,11.94 26.16,12.19 25.15,11.94 24.89,11.68 LED111.C | LED109.C LED107.C 24.64,2.03 24.89,1.78 LED105.C | LED116.A LED109.C | LED106.C LED108.C 27.94,6.1 LED110.C | LED140.A 8.13,18.29 v7.62,17.78 | LED132.A 12.19,11.94 v12.83,12.57 | LED124.A v16.89,8.51 | LED110.C 26.92,8.89 26.67,8.64 v26.67,7.62 26.67,7.11 26.42,6.86 LED109.C | LED101.A 32.51,8.38 v33.02,7.62 | LED93.A 35.81,11.43 v36.2,10.79 | LED85.A v41.53,16.13 | v42.67,20.32 42.04,21.21 LED77.A v42.55,23.37
  Bottom 0.127: v7.62,17.78 v12.83,12.57 v16.89,8.51 17.78,7.62 v26.67,7.62 v33.02,7.62 v36.2,10.79 v41.53,16.13 43.18,17.78 43.18,19.94 v42.67,20.32 | v42.55,23.37 43.81,23.24 44.07,23.37 44.96,23.37 45.21,23.11 U1.11
CB6  (via drill 0.33)
  Top 0.127: LED139.A v6.35,20.32 | LED131.A v7.62,16.51 | LED123.A 13.46,9.91 v14.22,9.91 | LED113.C LED115.C 19.56,5.33 v20.07,6.35 20.32,6.86 LED116.C | LED116.C LED118.C 21.59,9.14 LED120.C 21.34,11.94 21.08,10.41 LED119.C LED117.C | LED114.C 21.08,3.56 20.83,4.06 LED116.C | LED108.A 29.46,7.37 v29.97,6.35 | LED100.A v36.58,9.91 | LED92.A 40.13,14.22 v40.64,13.97 | LED84.A v44.45,19.3 | LED76.A v44.58,22.73
  Bottom 0.127: v6.35,20.32 6.35,17.78 v7.62,16.51 v14.22,9.91 17.78,6.35 v20.07,6.35 v29.97,6.35 33.02,6.35 v36.58,9.91 v40.64,13.97 44.45,17.78 v44.45,19.3 44.83,20.95 v44.58,22.73 44.84,22.48 U1.12
CB7  (via drill 0.33)
  Top 0.127: LED130.A LED123.C LED125.C 14.48,10.67 15.49,11.68 16,11.68 LED126.C | LED124.C LED122.C 13.46,6.35 11.43,6.35 LED121.C | LED126.C LED128.C 16,14.48 LED127.C | LED138.A v6.6,16.26 | LED115.A LED124.C | LED124.C v13.97,8.89 14.99,9.4 LED126.C | LED107.A v27.18,5.08 | LED99.A 30.99,6.1 v31.5,5.08 | LED91.A 39.62,10.92 v39.37,11.43 | LED83.A 41.91,14.73 v42.16,14.22 | LED75.A 45.72,23.37 46.1,23.62 v48.13,22.99
  Bottom 0.127: v6.6,16.26 v13.97,8.89 17.78,5.08 v27.18,5.08 v31.5,5.08 33.02,5.08 v39.37,11.43 v42.16,14.22 45.09,17.53 45.47,21.08 45.95,21.82 U1.13 47.62,21.84 47.88,22.1 47.88,22.73 v48.13,22.99
CB8  (via drill 0.33)
  Top 0.127: LED132.C LED134.C 11.68,15.24 12.14,16.58 | LED133.C LED135.C 12.14,16.58 | 12.14,16.58 12.19,16.51 13.21,16.26 LED136.C | LED114.A 21.59,5.08 22.86,4.57 v22.86,3.81 | LED137.A v3.81,20.32 3.81,17.78 LED129.C LED131.C 7.62,14.22 9.65,14.22 LED132.C | LED130.C 7.87,11.94 LED132.C | LED122.A v16.13,5.46 | LED106.A 30.73,4.32 v30.99,3.81 | LED98.A v37.21,8 | LED90.A 42.93,12.95 v42.55,13.34 | LED82.A 45.47,19.05 v45.97,19.05 46.99,18.67 48.77,19.05 49.15,19.68 49.28,20.45 49.53,22.35 49.28,22.86 48.64,23.5 48.01,23.88 48.01,25.78 47.5,26.16 LED74.A
  Bottom 0.127: v3.81,20.32 3.81,17.78 v16.13,5.46 17.78,3.81 v22.86,3.81 v30.99,3.81 33.02,3.81 v37.21,8 v42.55,13.34 45.72,17.14 v45.97,19.05 46.99,21.18 U1.14
CB9  (via drill 0.33)
  Top 0.127: LED144.C LED142.C | LED140.C LED138.C 4.8,19.02 | LED139.C LED141.C 7.62,20.83 8.89,20.32 LED142.C | LED143.C 9.4,22.86 LED142.C | LED137.C v2.54,22.86 4.32,23.62 5.01,23.37 LED139.C | 4.8,19.02 4.57,21.59 4.57,22.35 5.08,22.61 LED139.C | 4.8,19.02 4.83,18.8 | LED121.A 10.41,9.14 8.38,9.14 7.11,10.67 LED129.A 6.6,13.72 v7.49,12.83 | LED113.A v19.56,2.54 | LED105.A v26.67,2.54 | LED97.A v35.18,4.7 | LED89.A 40.39,9.14 v40.39,9.91 | LED73.A 47.5,22.35 v48.77,22.35 | LED81.A v46.23,15.75 | v43.05,21.21 43.69,20.32 v46.99,19.43
  Bottom 0.127: v2.54,22.86 2.54,17.78 v7.49,12.83 17.78,2.54 v19.56,2.54 v26.67,2.54 33.02,2.54 v35.18,4.7 v40.39,9.91 v46.23,15.75 46.23,16.51 46.99,18.67 v46.99,19.43 47.75,20.7 v48.77,22.35 | U1.15 40.61,21.18 41.02,21.59 42.8,21.59 v43.05,21.21
GND  (via drill 0.33)
  Top 0.127: v32.89,17.02 32.89,18.16 v31.3,19.75
  Bottom 0.127: 21.21,16.13 21.21,18.41 22.23,19.43 31.11,19.43 v31.3,19.75 31.75,19.68 33.27,21.21 | 45.59,27.3 45.87,27.02 | C1.2 36.61,19.27 37.08,18.8 37.08,18 C3.2 C4.2 C5.2 33.11,17.87 32.77,17.53 v32.89,17.02 | 48.92,27.24 R6.1
  Bottom 0.254: U$1.2 21.21,16.13 | 33.27,21.21 34.42,21.21 34.61,21.4 34.61,22.23 35.56,23.24 35.56,29.46 36.32,30.23 42.16,30.23 43.56,28.83 45.09,28.83 45.59,28.32 45.59,27.3 | 45.87,27.02 U1.5 47.98,27.02 48.2,27.24 48.92,27.24
  pour Bottom (isolate 0.254): 20.32,27.94 52.07,27.94 52.07,11.43 20.32,11.43
INTB  (via drill 0.33)
  Top 0.127: v18.8,15.75 26.67,15.75 U$1.5 | v49.02,28.32 48.26,27.56 45.47,27.56 44.45,27.05 38.54,27.05 37.59,26.1 37.59,22.92 36.89,22.23 36.45,22.23 35.56,21.34 35.56,20.45 v34.54,19.43
  Bottom 0.127: R2.1 18.38,16.17 v18.8,15.75 | U1.4 47.87,27.68 48.51,28.32 v49.02,28.32 | v34.54,19.43 34.29,19.18 33.27,19.18 31.11,17.02 U$1.5
N$9
  Bottom 0.127: U1.6 47.67,26.38 48.26,25.78 48.98,25.78 R6.2
N$10
  Bottom 0.127: C1.1 38.35,21.06 38.35,21.46 38.72,21.82 U1.16
SCL  (via drill 0.33)
  Top 0.127: v14.48,22.23 14.48,18.8 16.26,17.02 16.26,15.88 17.02,15.11 18.8,15.11 19.94,13.97 19.94,13.21 20.32,12.83 23.75,12.83 U$1.4
  Bottom 0.127: U$1.4 25.4,14.86 24.13,16.13 24.13,17.78 25.02,18.67 31.75,18.67 33.53,20.45 35.05,20.45 35.43,20.83 35.43,21.97 37.89,24.43 U1.20 | R4.1 14.61,22.1 v14.48,22.23
SDA  (via drill 0.33)
  Top 0.127: v15.88,22.35 15.88,19.56 16.76,18.67 23.37,18.67 25.02,17.02 U$1.3
  Bottom 0.127: U$1.3 26.67,18.29 31.88,18.29 33.66,20.07 35.31,20.07 35.81,20.57 35.81,21.84 37.74,23.77 U1.19 | R5.1 16.51,21.72 v15.88,22.35
SHD  (via drill 0.33)
  Top 0.127: U$1.6 29.72,16.26 33.78,16.26 36.2,18.67 36.2,21.53 36.58,21.91 37.02,21.91 37.97,22.86 37.97,26.04 38.48,26.54 40.2,26.54 40.45,26.8 44.58,26.8 45.47,27.24 48.9,27.24 49.53,27.81 49.66,28.57 49.15,29.21 v49.06,30.27
  Bottom 0.127: R1.2 v49.06,30.27 49.06,29.31 48.85,28.98 48.64,28.96 48.13,28.83 47.62,28.32 U1.3
VCC  (via drill 0.33)
  Top 0.254: v36.32,27.94 35.69,28.83 v35.56,30.73 | v18.67,17.91 21.97,17.91 U$1.1 | v32.77,15.62 v31.11,15.62
  Bottom 0.127: 18.63,17.87 v18.67,17.91 | 47.5,31.28 R3.2 | 48.82,31.41 R1.1
  Bottom 0.254: v36.32,27.94 35.94,27.18 36.07,23.11 35.05,22.1 35.05,21.08 34.8,20.83 33.4,20.83 31.62,19.05 24.51,19.05 22.86,17.4 U$1.1 23.24,16.64 23.24,16.38 24.13,15.49 24.13,13.59 24.64,13.08 29.21,13.08 31.11,14.99 v31.11,15.62 | v35.56,30.73 42.29,30.73 43.8,29.23 45.59,29.21 45.85,28.96 U1.2 47.64,28.98 47.88,29.21 47.88,30.35 47.5,30.73 47.5,31.28 | R4.2 R5.2 R2.2 18.63,17.87 | C3.1 C4.1 C5.1 33.19,16.17 v32.77,15.62 | R3.2 48.82,31.41

### Text on the board
bNames: DO OR DONUT | @davedarko | 2019 | AUDIO_IN